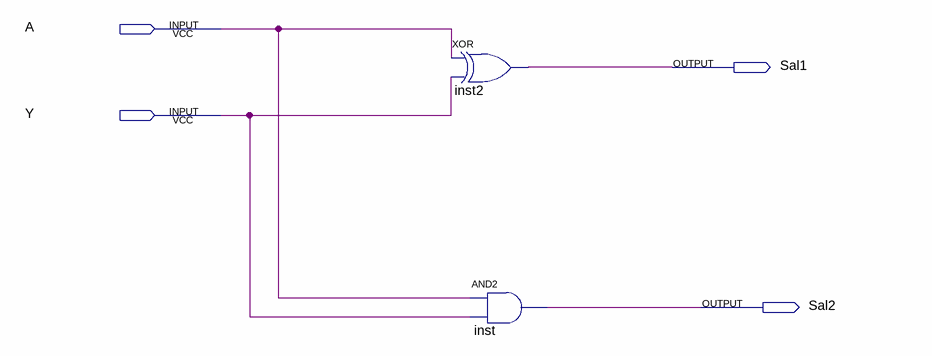
[diagram p0: schematic sheet]
// Quartus schematic Pract2.bdf as structural Verilog: 2 symbols, 4 pins
module Pract2 (
  input  A,
  input  Y,
  output Sal1,
  output Sal2
);

  xor inst2 (Sal1, A, Y);
  and inst (Sal2, A, Y);
endmodule
